# Altium schematic sheet LiDAR_mainboard.SchDoc
size A2; Origin: Eagle; SPICEModelCacheOKYPEHMT: <root> / <DocumentId>OKYPEHMT</DocumentId> / </root>
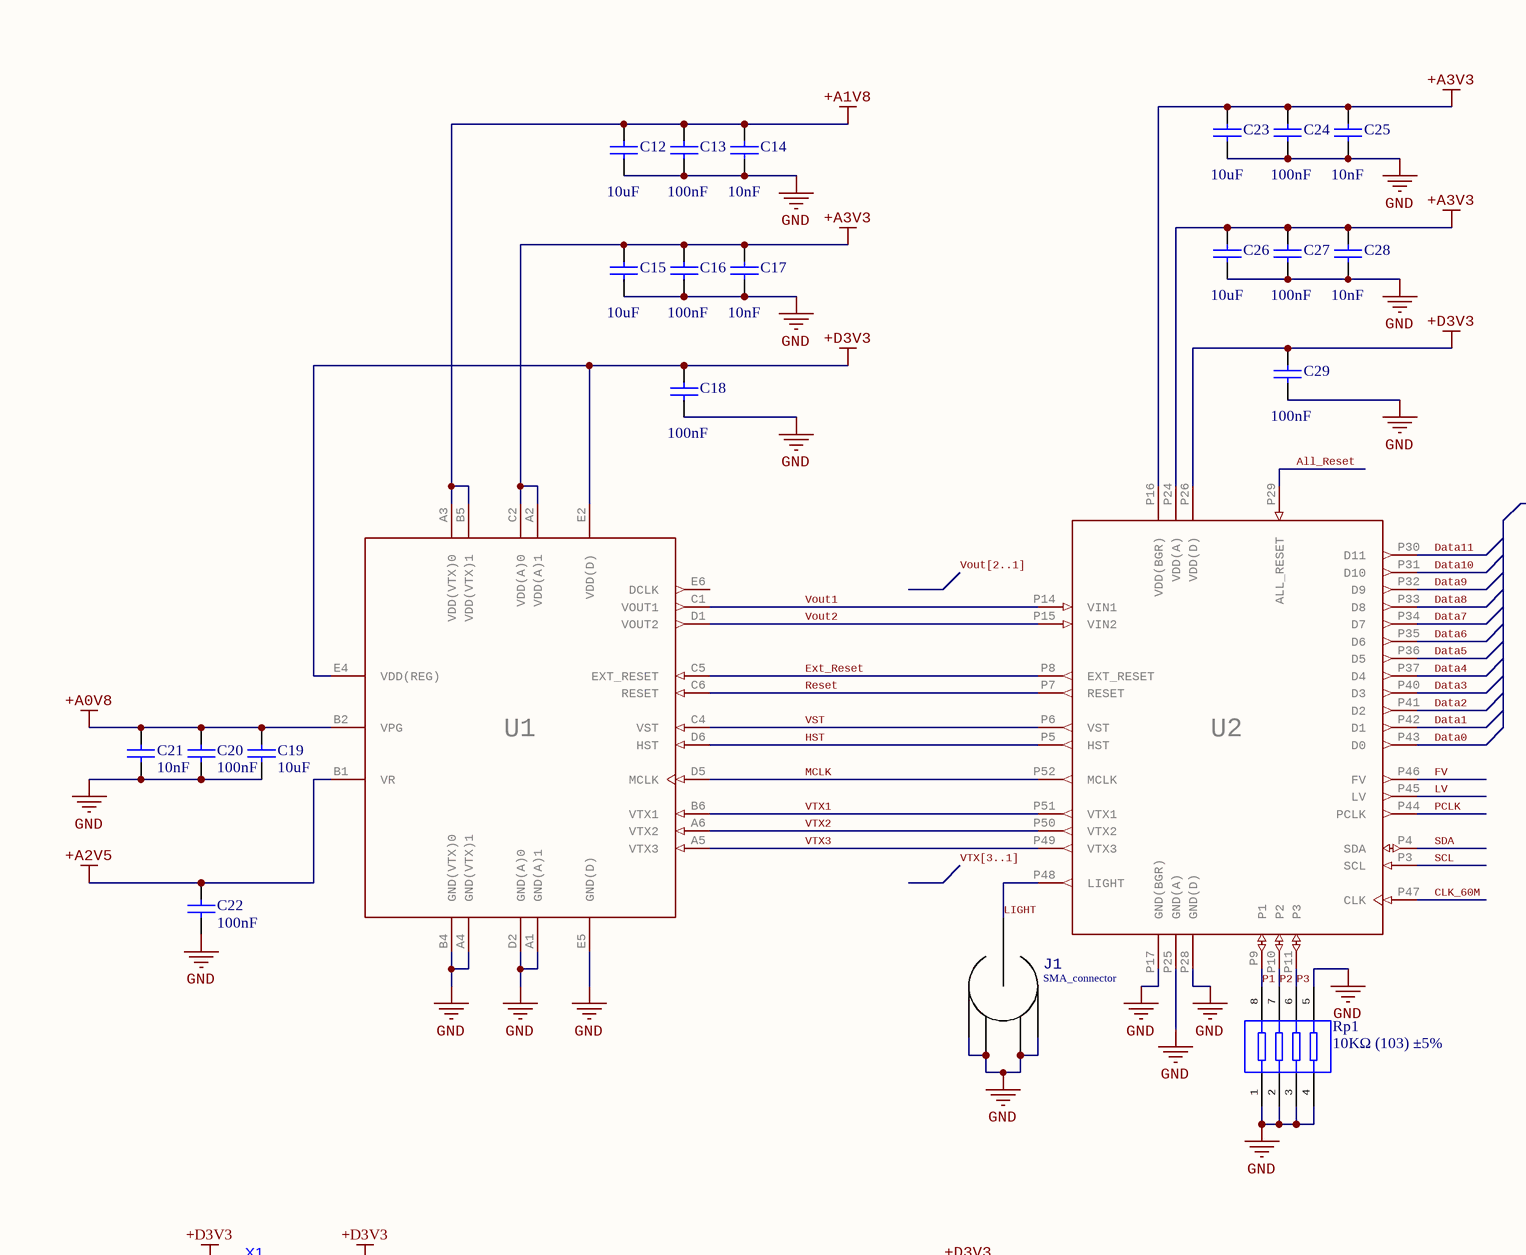
[diagram p0: LiDAR_mainboard.SchDoc, top left]
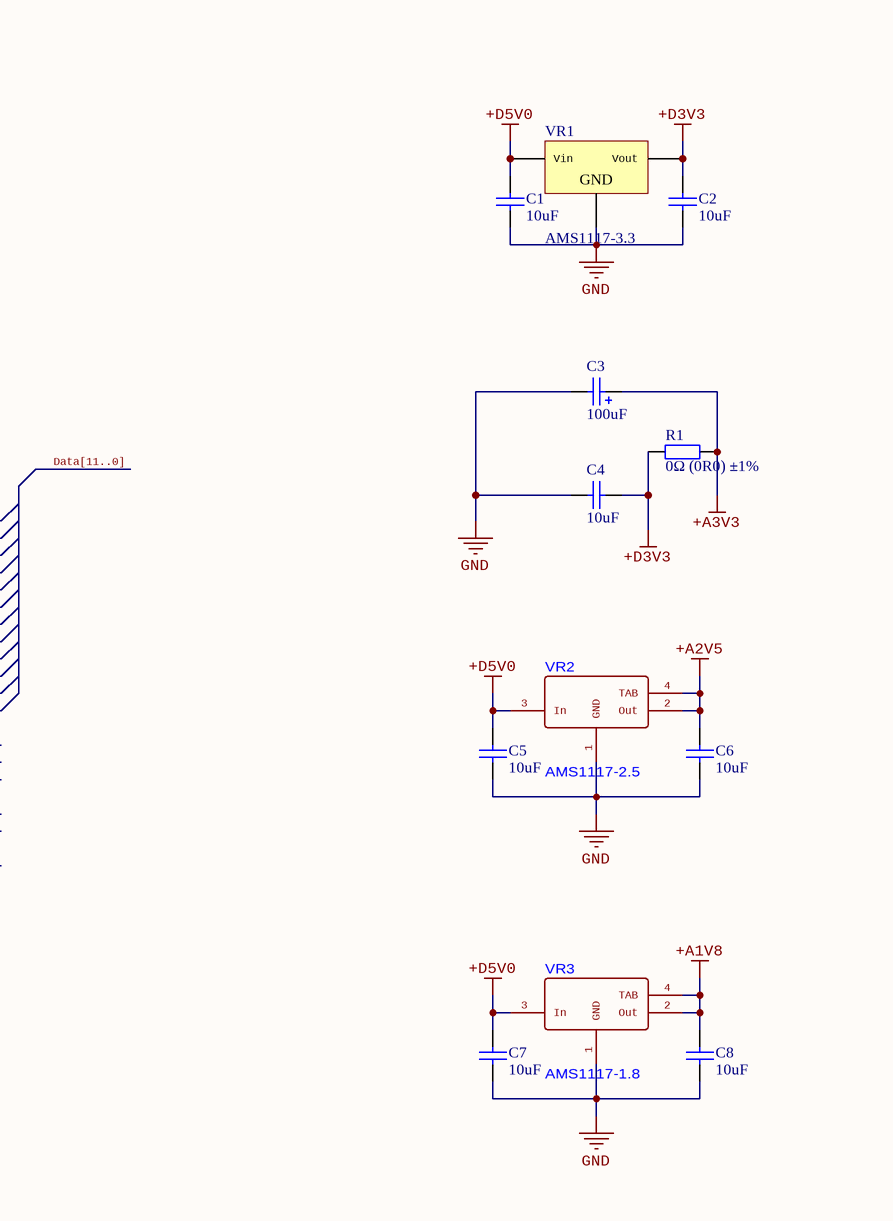
[diagram p1: LiDAR_mainboard.SchDoc, top right]
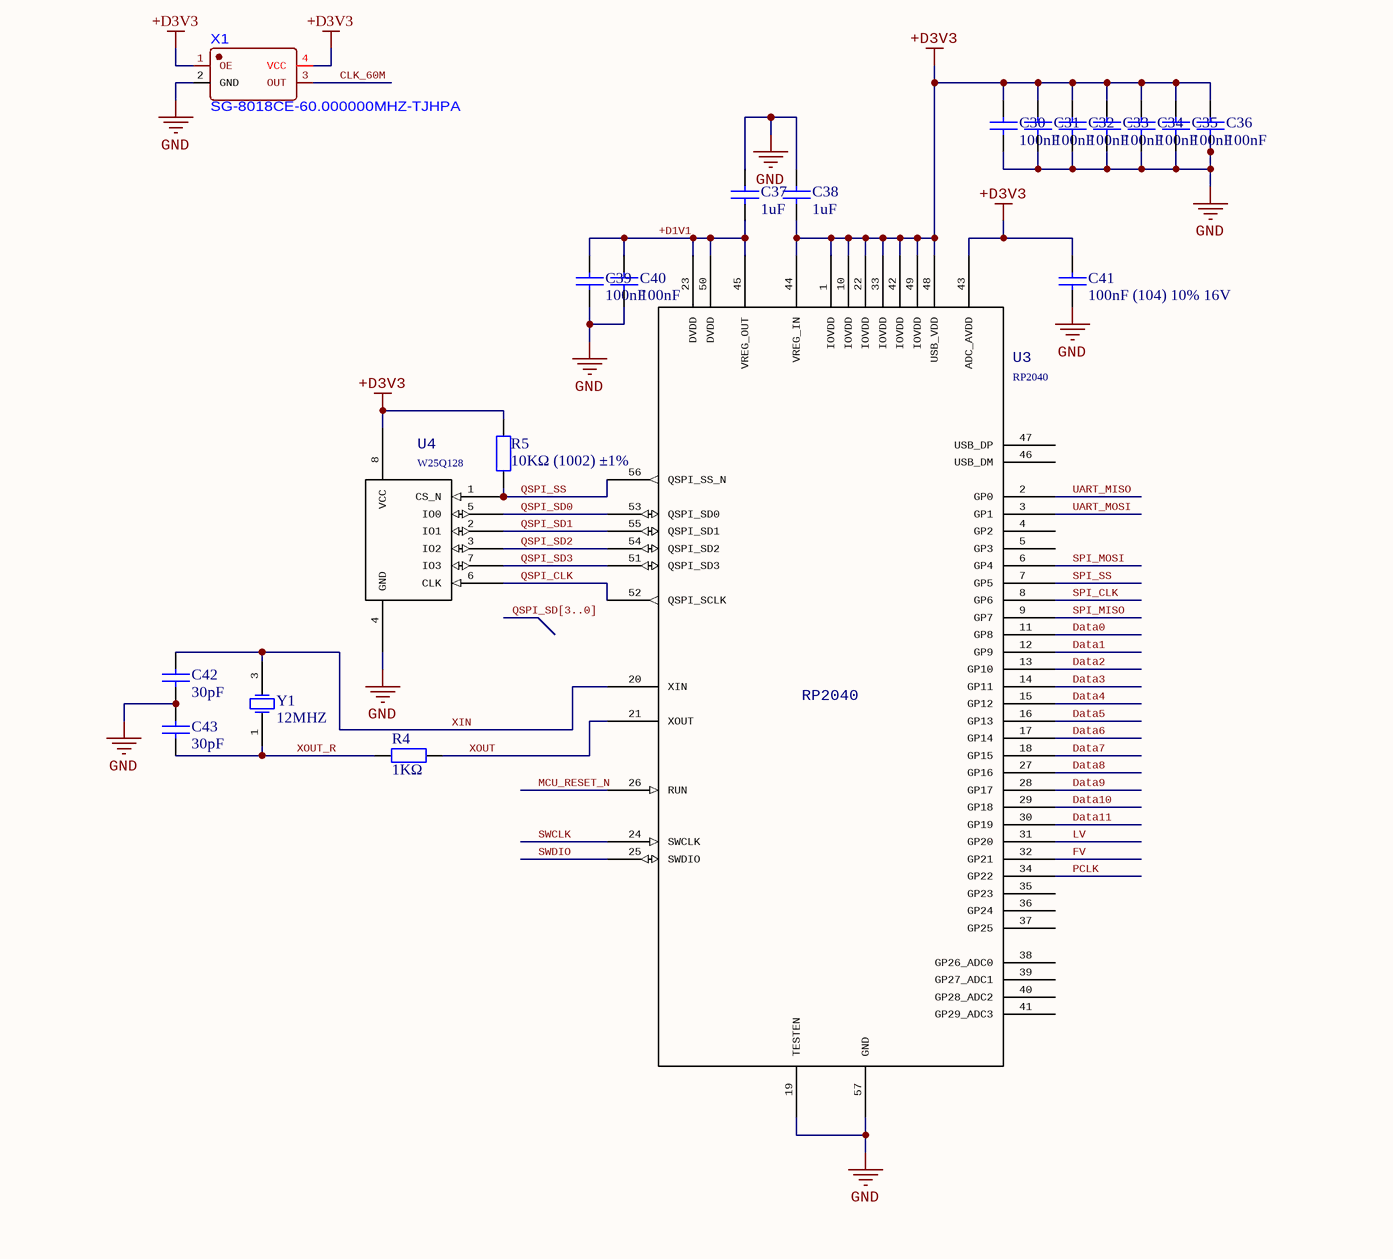
[diagram p2: LiDAR_mainboard.SchDoc, bottom left]
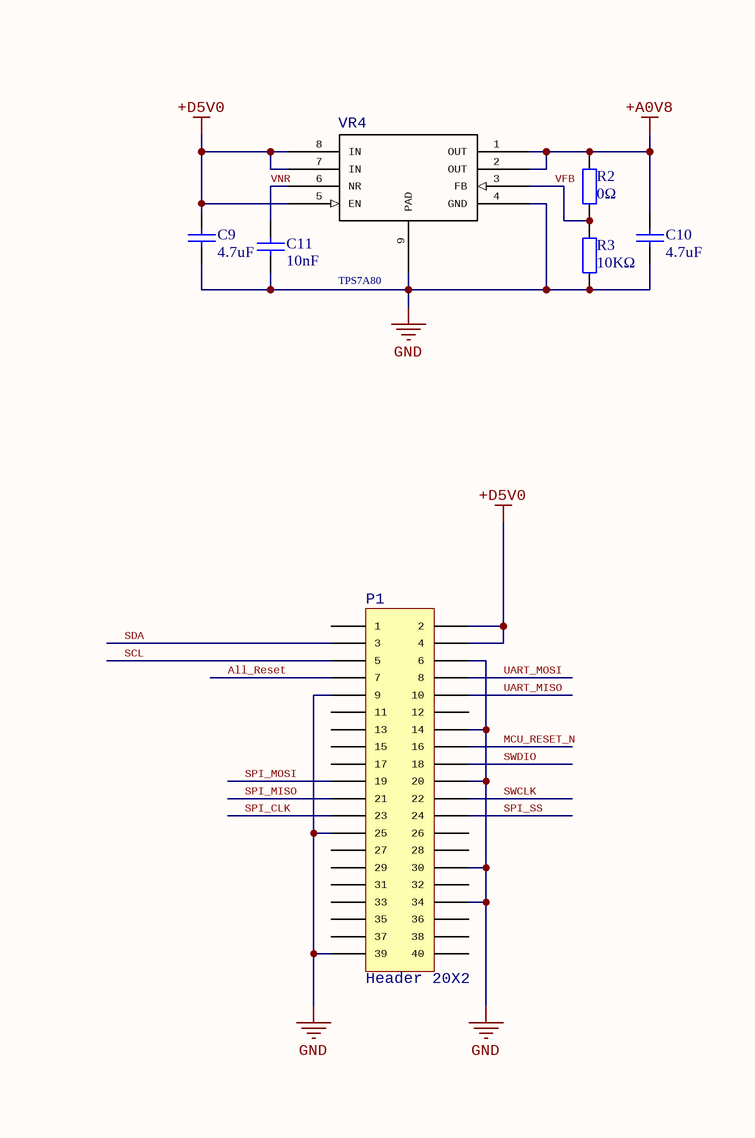
[diagram p3: LiDAR_mainboard.SchDoc, bottom right]

## Parts
C1  10uF  [0402_C]
C2  10uF  [0402_C]
C3  100uF  [CASE-B_3528]
C4  10uF  [0603_C]
C5  10uF  [0402_C]
C6  10uF  [0402_C]
C7  10uF  [0402_C]
C8  10uF  [0402_C]
C9  4.7uF  [0402_C]
C10  4.7uF  [0402_C]
C11  10nF  [0402_C]
C12  10uF  [0402_C]
C13  100nF  [0402_C]
C14  10nF  [0402_C]
C15  10uF  [0402_C]
C16  100nF  [0402_C]
C17  10nF  [0402_C]
C18  100nF  [0402_C]
C19  10uF  [0402_C]
C20  100nF  [0402_C]
C21  10nF  [0402_C]
C22  100nF  [0402_C]
C23  10uF  [0402_C]
C24  100nF  [0402_C]
C25  10nF  [0402_C]
C26  10uF  [0402_C]
C27  100nF  [0402_C]
C28  10nF  [0402_C]
C29  100nF  [0402_C]
C30  100nF  [0402_C]
C31  100nF  [0402_C]
C32  100nF  [0402_C]
C33  100nF  [0402_C]
C34  100nF  [0402_C]
C35  100nF  [0402_C]
C36  100nF  [0402_C]
C37  1uF  [0603_C]
C38  1uF  [0603_C]
C39  100nF  [0402_C]
C40  100nF  [0402_C]
C41  100nF (104) 10% 16V  [0402_C]
C42  30pF  [0402_C]
C43  30pF  [0402_C]
J1  SMA_connector  [SMA_header]
P1  Header 20X2  [HDR2X20]  (no BOM)
R1  0Ω (0R0) ±1%  [0805_R]
R2  0Ω  [0603_R]
R3  10KΩ  [0603_R]
R4  1KΩ  [0402_R]
R5  10KΩ (1002) ±1%  [0603_R]
Rp1  10KΩ (103) ±5%  [0402_Rx4]
U1  S15454-01WT Distance Area Image Sensor  [S15454-01WT]  (value not drawn)
U2  H15472-01  [H15472-01]  (value not drawn)
U3  RP2040  [QFN-56]
U4  W25Q128  [SOIC-8]
VR1  AMS1117-3.3  [SOT-223]
VR2  AMS1117-2.5  [SOT-223-4_L6.5-W3.5-P2.30-LS7.0-BR]
VR3  AMS1117-1.8  [SOT-223-4_L6.5-W3.5-P2.30-LS7.0-BR]
VR4  TPS7A80  [SON_8]
X1  SG-8018CE-60.000000MHZ-TJHPA  [OSC-SMD_4P-L3.2-W2.5-BL_SIT8008BI]
Y1  12MHZ  [SMD-3225_4P]

## Nets
+A0V8: C10.2 C19.2 C20.2 C21.2 R2.2 U1.B2(VPG) VR4.1(OUT) VR4.2(OUT)
+A1V8: C8.2 C12.2 C13.2 C14.2 U1.A3(VDD(VTX)0) U1.B5(VDD(VTX)1) VR3.2(Out) VR3.4(TAB)
+A2V5: C6.2 C22.2 U1.B1(VR) VR2.2(Out) VR2.4(TAB)
+A3V3: C3.1 C15.2 C16.2 C17.2 C23.2 C24.2 C25.2 C26.2 C27.2 C28.2 R1.2 U1.A2(VDD(A)1) U1.C2(VDD(A)0) U2.P16(VDD(BGR)) U2.P24(VDD(A))
+D3V3: C2.2 C4.1 C18.2 C29.2 C30.2 C31.2 C32.2 C33.2 C34.2 C35.2 C36.2 C38.1 C41.2 R1.1 R5.2 U1.E2(VDD(D)) U1.E4(VDD(REG)) U2.P26(VDD(D)) U3.1(IOVDD) U3.10(IOVDD) U3.22(IOVDD) U3.33(IOVDD) U3.42(IOVDD) U3.43(ADC_AVDD) U3.44(VREG_IN) U3.48(USB_VDD) U3.49(IOVDD) U4.8(VCC) VR1.2(Vout) X1.1(OE) X1.4(VCC)
+D5V0: C1.2 C5.2 C7.2 C9.2 P1.2 P1.4 VR1.3(Vin) VR2.3(In) VR3.3(In) VR4.5(EN) VR4.7(IN) VR4.8(IN)
GND: C1.1 C2.1 C3.2 C4.2 C5.1 C6.1 C7.1 C8.1 C9.1 C10.1 C11.1 C12.1 C13.1 C14.1 C15.1 C16.1 C17.1 C18.1 C19.1 C20.1 C21.1 C22.1 C23.1 C24.1 C25.1 C26.1 C27.1 C28.1 C29.1 C30.1 C31.1 C32.1 C33.1 C34.1 C35.1 C36.1 C37.2 C38.2 C39.1 C40.1 C41.1 C42.1 C43.2 J1.2(GND) J1.3(GND) J1.4(GND) J1.5(GND) P1.6 P1.9 P1.14 P1.20 P1.25 P1.30 P1.34 P1.39 R3.1 Rp1.1 Rp1.2 Rp1.3 Rp1.4 Rp1.5 U1.A1(GND(A)1) U1.A4(GND(VTX)1) U1.B4(GND(VTX)0) U1.D2(GND(A)0) U1.E5(GND(D)) U2.P17(GND(BGR)) U2.P25(GND(A)) U2.P28(GND(D)) U3.19(TESTEN) U3.57(GND) U4.4(GND) VR1.1(GND) VR2.1(GND) VR3.1(GND) VR4.4(GND) VR4.9(PAD) X1.2(GND)
+D1V1: C37.1 C39.2 C40.2 U3.23(DVDD) U3.45(VREG_OUT) U3.50(DVDD)
All_Reset: P1.7 U2.P29(ALL_RESET)
CLK_60M: U2.P47(CLK) X1.3(OUT)
Data0: U2.P43(D0) U3.11(GP8)
Data1: U2.P42(D1) U3.12(GP9)
Data2: U2.P41(D2) U3.13(GP10)
Data3: U2.P40(D3) U3.14(GP11)
Data4: U2.P37(D4) U3.15(GP12)
Data5: U2.P36(D5) U3.16(GP13)
Data6: U2.P35(D6) U3.17(GP14)
Data7: U2.P34(D7) U3.18(GP15)
Data8: U2.P33(D8) U3.27(GP16)
Data9: U2.P32(D9) U3.28(GP17)
Data10: U2.P31(D10) U3.29(GP18)
Data11: U2.P30(D11) U3.30(GP19)
Ext_Reset: U1.C5(EXT_RESET) U2.P8(EXT_RESET)
FV: U2.P46(FV) U3.32(GP21)
HST: U1.D6(HST) U2.P5(HST)
LIGHT: J1.1(CORE) U2.P48(LIGHT)
LV: U2.P45(LV) U3.31(GP20)
MCLK: U1.D5(MCLK) U2.P52(MCLK)
MCU_RESET_N: P1.16 U3.26(RUN)
P1: Rp1.8 U2.P9(P1)
P2: Rp1.7 U2.P10(P2)
P3: Rp1.6 U2.P11(P3)
PCLK: U2.P44(PCLK) U3.34(GP22)
QSPI_CLK: U3.52(QSPI_SCLK) U4.6(CLK)
QSPI_SD0: U3.53(QSPI_SD0) U4.5(IO0)
QSPI_SD1: U3.55(QSPI_SD1) U4.2(IO1)
QSPI_SD2: U3.54(QSPI_SD2) U4.3(IO2)
QSPI_SD3: U3.51(QSPI_SD3) U4.7(IO3)
QSPI_SS: R5.1 U3.56(QSPI_SS_N) U4.1(CS_N)
Reset: U1.C6(RESET) U2.P7(RESET)
SCL: P1.5 U2.P3(SCL)
SDA: P1.3 U2.P4(SDA)
SPI_CLK: P1.23 U3.8(GP6)
SPI_MISO: P1.21 U3.9(GP7)
SPI_MOSI: P1.19 U3.6(GP4)
SPI_SS: P1.24 U3.7(GP5)
SWCLK: P1.22 U3.24(SWCLK)
SWDIO: P1.18 U3.25(SWDIO)
UART_MISO: P1.10 U3.2(GP0)
UART_MOSI: P1.8 U3.3(GP1)
VFB: R2.1 R3.2 VR4.3(FB)
VNR: C11.2 VR4.6(NR)
Vout1: U1.C1(VOUT1) U2.P14(VIN1)
Vout2: U1.D1(VOUT2) U2.P15(VIN2)
VST: U1.C4(VST) U2.P6(VST)
VTX1: U1.B6(VTX1) U2.P51(VTX1)
VTX2: U1.A6(VTX2) U2.P50(VTX2)
VTX3: U1.A5(VTX3) U2.P49(VTX3)
XIN: C42.2 U3.20(XIN) Y1.3(OSC2)
XOUT: R4.2 U3.21(XOUT)
XOUT_R: C43.1 R4.1 Y1.1(OSC1)

Not connected (* = marked no-connect by the designer): P1 1 11 12 13 15 17 26 27 28 29 31 32 33 35 36 37 38 40; U1 E6(DCLK); U3 4(GP2) 5(GP3) 35(GP23) 36(GP24) 37(GP25) 38(GP26_ADC0) 39(GP27_ADC1) 40(GP28_ADC2) 41(GP29_ADC3) 46(USB_DM) 47(USB_DP)

## Buses and harness runs
bus Data[11..0]
bus QSPI_SD[3..0]
bus Vout[2..1]
bus VTX[3..1]

## Library data of the parts
C1 C2 C5-C8 C12 C15 C19 C23 C26 = 0402 10uF (106) 20% 6.3V: 贴片电容; ComponentLink1Description: 供应商链接; ComponentLink1URL: http://www.szlcsc.com/product/details_16204.html; Package: 0402; Supplier: LC; SuppliersPartNumber: C15525
C3 = 3528 100uF (107) 10% 6.3V: 钽电容; ComponentLink1Description: 供应商链接; ComponentLink1URL: http://www.szlcsc.com/product/details_16815.html; Package: 3528; Supplier: LC; SuppliersPartNumber: C16133
C4 = 0603 10uF (106) 10% 10V: 贴片电容; ComponentLink1Description: 供应商链接; ComponentLink1URL: http://www.szlcsc.com/product/details_20411.html; Package: 0603; Supplier: LC; SuppliersPartNumber: C19702
C9 C10 = 0402 4.7uF (475) 20% 10V: 贴片电容; ComponentLink1Description: 供应商链接; ComponentLink1URL: http://www.szlcsc.com/product/details_24469.html; Package: 0402; Supplier: LC; SuppliersPartNumber: C23733
C11 C14 C17 C21 C25 C28 = 0402 10nF (103) 10% 50V: 贴片电容; ComponentLink1Description: 供应商链接; ComponentLink1URL: http://www.szlcsc.com/product/details_15869.html; Package: 0402; Supplier: LC; SuppliersPartNumber: C15195
C13 C16 C18 C20 C22 C24 C27 C29-C36 C39-C41 = 0402 100nF (104) 10% 16V: 贴片电容; ComponentLink1Description: 供应商链接; ComponentLink1URL: http://www.szlcsc.com/product/details_1877.html; Package: 0402; Supplier: LC; SuppliersPartNumber: C1525
C37 C38 = 0603 1uF (105) 10% 50V: 贴片电容; ComponentLink1Description: 供应商链接; ComponentLink1URL: http://www.szlcsc.com/product/details_16531.html; Package: 0603; Supplier: LC; SuppliersPartNumber: C15849
C42 C43 = 0402 30pF (300) 5% 50V: 贴片电容; ComponentLink1Description: 供应商链接; ComponentLink1URL: http://www.szlcsc.com/product/details_1922.html; Package: 0402; Supplier: LC; SuppliersPartNumber: C1570
P1 = Header 20X2: Header, 20-Pin, Dual row; LatestRevisionDate: 17-Jul-2002; LatestRevisionNote: Re-released for DXP Platform.; Publisher: Altium Limited
R1 = 0805 0Ω (0R0) 1%: 贴片电阻; ComponentLink1Description: 供应商链接; ComponentLink1URL: http://www.szlcsc.com/product/details_18165.html; Package: 0805; Supplier: LC; SuppliersPartNumber: C17477
R2 = 0603 0Ω (0R0) 1%: 贴片电阻; ComponentLink1Description: 供应商链接; ComponentLink1URL: http://www.szlcsc.com/product/details_21903.html; Package: 0603; Supplier: LC; SuppliersPartNumber: C21189
R3 R5 = 0603 10KΩ (1002) 1%: 贴片电阻; ComponentLink1Description: 供应商链接; ComponentLink1URL: http://www.szlcsc.com/product/details_26547.html; Package: 0603; Supplier: LC; SuppliersPartNumber: C25804
R4 = 0402 1KΩ (1001) 1%: 贴片电阻; ComponentLink1Description: 供应商链接; ComponentLink1URL: http://www.szlcsc.com/product/details_12256.html; Package: 0402; Supplier: LC; SuppliersPartNumber: C11702
Rp1 = 0402*4 10KΩ (103) 5%: 贴片排阻; ComponentLink1Description: 供应商链接; ComponentLink1URL: http://www.szlcsc.com/product/details_26468.html; Package: 0402*4; Supplier: LC; SuppliersPartNumber: C25725
U1 = S15454-01WT: Hamamatsu area distance image sensor; GateName_1: G$1; SymbolName_1: S15454-01WT; LibraryName: Hamamatsu Distance Image Sensors; DeviceSetName: S15454-01WT; Package: S15454-01WT
U2 = H15472-01: ASIC for distance image sensors; GateName_1: G$1; SymbolName_1: H15472-01; LibraryName: Hamamatsu Distance Image Sensors; DeviceSetName: H15472-01; Package: H15472-01
VR1 = SOT-223 AMS1117-3.3: 低压差线性稳压(LDO); ComponentLink1Description: 供应商链接; ComponentLink1URL: http://www.szlcsc.com/product/details_6652.html; Package: SOT-223; Supplier: LC; SuppliersPartNumber: C6186
Y1 = SMD-3225_4P  12MHZ 20PF 10PPM: 贴片晶振; ComponentLink1Description: 供应商链接; ComponentLink1URL: http://www.szlcsc.com/product/details_9522.html; Package: SMD-3225_4P; Supplier: LC; SuppliersPartNumber: C9002